# Altium schematic sheet PWMControl.SchDoc: fNIRS - PWM Control
size A4; CompanyName: UofT Capstone Team 2024991; Revision: 1; SheetNumber: 7; SheetTotal: 14
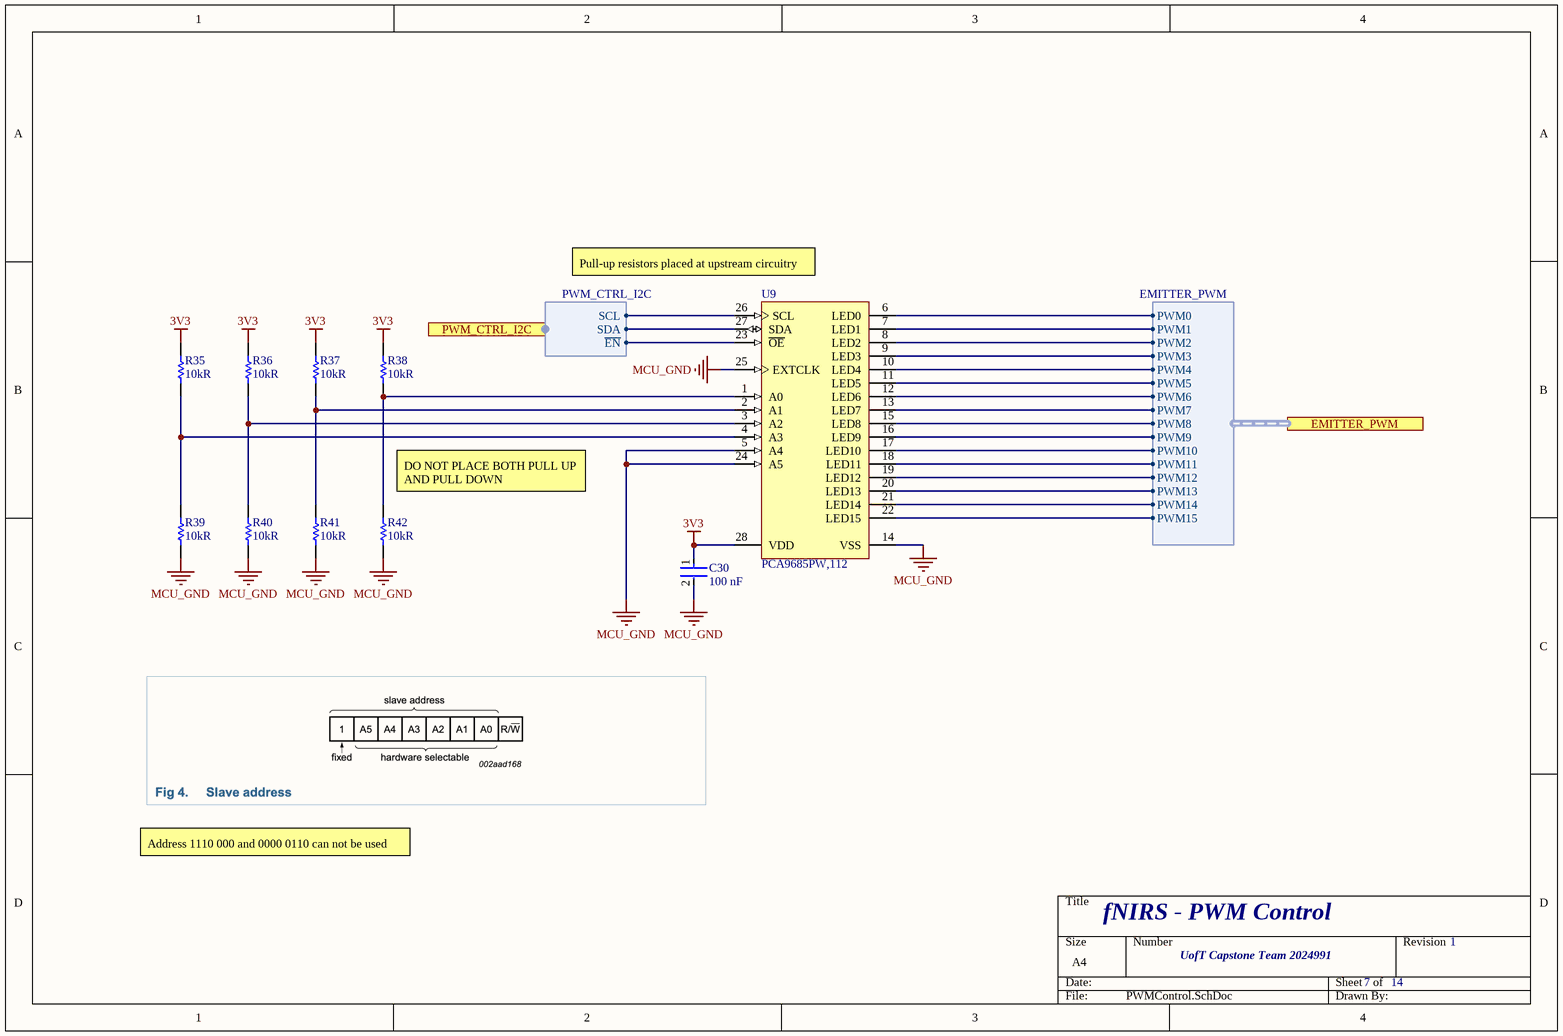
[diagram p0: PWMControl.SchDoc]

## Parts
C30  Capacitance: 100 nF  [FP-CC0603-DA-MFG]  (hidden comment: CC0603KRX7R7BB104)
R35  Resistance: 10kR  [RESC1609X50X30NL8T20]  (hidden comment: CRCW060310K0FKEA)
R36  Resistance: 10kR  [RESC1609X50X30NL8T20]  (hidden comment: CRCW060310K0FKEA)
R37  Resistance: 10kR  [RESC1609X50X30NL8T20]  (hidden comment: CRCW060310K0FKEA)
R38  Resistance: 10kR  [RESC1609X50X30NL8T20]  (hidden comment: CRCW060310K0FKEA)
R39  Resistance: 10kR  [RESC1609X50X30NL8T20]  (hidden comment: CRCW060310K0FKEA)
R40  Resistance: 10kR  [RESC1609X50X30NL8T20]  (hidden comment: CRCW060310K0FKEA)
R41  Resistance: 10kR  [RESC1609X50X30NL8T20]  (hidden comment: CRCW060310K0FKEA)
R42  Resistance: 10kR  [RESC1609X50X30NL8T20]  (hidden comment: CRCW060310K0FKEA)
U9  PCA9685PW,112  [SOT361-1_V]

## Ports
EMITTER_PWM (harness EMITTER_PWM, see OptodeControl[3B], OptodeConnectors[1D]), PWM_CTRL_I2C (harness PWM_CTRL_I2C, see OptodeControl[2B])

## Harnesses
PWM_CTRL_I2C: SCL, SDA, ~{EN}
EMITTER_PWM: PWM0, PWM1, PWM2, PWM3, PWM4, PWM5, PWM6, PWM7, PWM8, PWM9, PWM10, PWM11, PWM12, PWM13, PWM14, PWM15

## Nets
3V3: C30.1 R35.2 R36.2 R37.2 R38.2 U9.28(VDD)
MCU_GND: C30.2 R39.1 R40.1 R41.1 R42.1 U9.5(A4) U9.14(VSS) U9.24(A5) U9.25(EXTCLK)
NetR35_1: R35.1 R39.2 U9.4(A3)
NetR36_1: R36.1 R40.2 U9.3(A2)
NetR37_1: R37.1 R41.2 U9.2(A1)
NetR38_1: R38.1 R42.2 U9.1(A0)
NetU9_6: U9.6(LED0) ; port EMITTER_PWM.PWM0
NetU9_7: U9.7(LED1) ; port EMITTER_PWM.PWM1
NetU9_8: U9.8(LED2) ; port EMITTER_PWM.PWM2
NetU9_9: U9.9(LED3) ; port EMITTER_PWM.PWM3
NetU9_10: U9.10(LED4) ; port EMITTER_PWM.PWM4
NetU9_11: U9.11(LED5) ; port EMITTER_PWM.PWM5
NetU9_12: U9.12(LED6) ; port EMITTER_PWM.PWM6
NetU9_13: U9.13(LED7) ; port EMITTER_PWM.PWM7
NetU9_15: U9.15(LED8) ; port EMITTER_PWM.PWM8
NetU9_16: U9.16(LED9) ; port EMITTER_PWM.PWM9
NetU9_17: U9.17(LED10) ; port EMITTER_PWM.PWM10
NetU9_18: U9.18(LED11) ; port EMITTER_PWM.PWM11
NetU9_19: U9.19(LED12) ; port EMITTER_PWM.PWM12
NetU9_20: U9.20(LED13) ; port EMITTER_PWM.PWM13
NetU9_21: U9.21(LED14) ; port EMITTER_PWM.PWM14
NetU9_22: U9.22(LED15) ; port EMITTER_PWM.PWM15
NetU9_23: U9.23(~{OE}) ; harness PWM_CTRL_I2C.~{EN}
NetU9_26: U9.26(SCL) ; harness PWM_CTRL_I2C.SCL
NetU9_27: U9.27(SDA) ; harness PWM_CTRL_I2C.SDA

## Notes on the sheet
- (near U9) Pull-up resistors placed at upstream circuitry
- (near R42) DO NOT PLACE BOTH PULL UP AND PULL DOWN
- Address 1110 000 and 0000 0110 can not be used

## Library data of the parts
C30 = CMP-2000-05002-2: CAP CER 0.1UF 16V X7R 0603; Manufacturer: YAGEO; Tolerance: 0.1; Value: 100 nF; Temperature Coefficient: 15%; Material: Ceramic; Voltage Rating: 16 V; Package: CC0603-DA; ComponentLink2Description: Datasheet; Octopart: https://octopart.com/cc0603krx7r7bb104-yageo-192941; Temperature Range High: +125°C; Digikey Description: CAP CER 0.1UF 16V X7R 0603; Voltage: 16 V; Device Class L2: Capacitors; Height: 0.9mm; Temperature: -55°C to +125°C; Manufacturer Part Number: CC0603KRX7R7BB104; Device Class L1: Passive Components; Device Class L3: Ceramic Capacitors; ComponentLink2URL: http://www.yageo.com/documents/recent/UPY-GPHC_X7R_6.3V-to-50V_18.pdf; Footprint Url: http://www.yageo.com/exep/pages/download/literatures/UPY-C_GEN_24.pdf; RoHS: TRUE; Temperature Range Low: -55°C; Temperature Characteristic: X7R; Lead Free: Yes; Category: Cap; Mouser Description: Multilayer Ceramic Capacitor, CC Series, 0.1 - F, - 10%, X7R, 16 V, 0603 [1608 Metric]; Automotive: No
R35-R42 = CMP-1666-00005-4: Chip Resistor, 10 KOhm, +/- 1%, 100 mW, -55 to 155 degC, 0603 (1608 Metric), RoHS, Tape and Reel; Manufacturer: Vishay Semiconductor; Voltage Rating: 75 V; Max Operating Temperature: 155 degC; PackageDescription: 2-Pin Surface Mount Device, Body 1.575 x 0.85 mm; ComponentLink1Description: Manufacturer URL; RoHSCompliant: true; PackageReference: 0603; REACH SVHC: Unknown; Length: 1.55 mm; DatasheetVersion: 06/2012; Packaging: Tape and Reel; Min Operating Temperature: -55 degC; Mounting Technology: Surface Mount; ComponentLink2URL: https://datasheet.ciiva.com/11809/0900766b80d98afc-11809037.pdf; Height: 0.45 mm; ComponentLink2Description: Datasheet; Package Quantity: 5000; ComponentLink1URL: http://www.vishay.com/
U9 = CMP-1595-00004-2: 16-Channel, 12-Bit PWM Fm+ I2C-Bus LED Controller, 2.3 to 5.5 V, -40 to 85 degC, 28-Pin TSSOP (SOT361-1), RoHS, Tape and Reel; Supply Current Max: 10 mA; Supply Voltage Min: 2.3 V; Supply Voltage Max: 5.5 V; Frequency: 25000000 Hz; Temperature Min: -40 degC; PackageDescription: 28-Pin Small Outline Package, Body 9.7 x 4.4 mm, Pitch 0.65 mm; RoHS: TRUE; ComponentLink1Description: Manufacturer URL; Code_JEDEC: MO-153; PartNumber: PCA9685; ComponentLink2URL: http://www.nxp.com/documents/data_sheet/PCA9685.pdf; Packing: Tape and Reel; ComponentLink1URL: http://www.nxp.com/; ComponentLink3Description: Package Specification; ComponentLink2Description: Datasheet; ComponentLink3URL: http://www.nxp.com/documents/outline_drawing/sot361-1_po.pdf; DatasheetVersion: Rev. 4; Temperature Max: 85 degC; PackageVersion: 02/2003; Mounting Technology: Surface Mount